# EAGLE design ws2812_Sqaure (EAGLE 8.7.1)
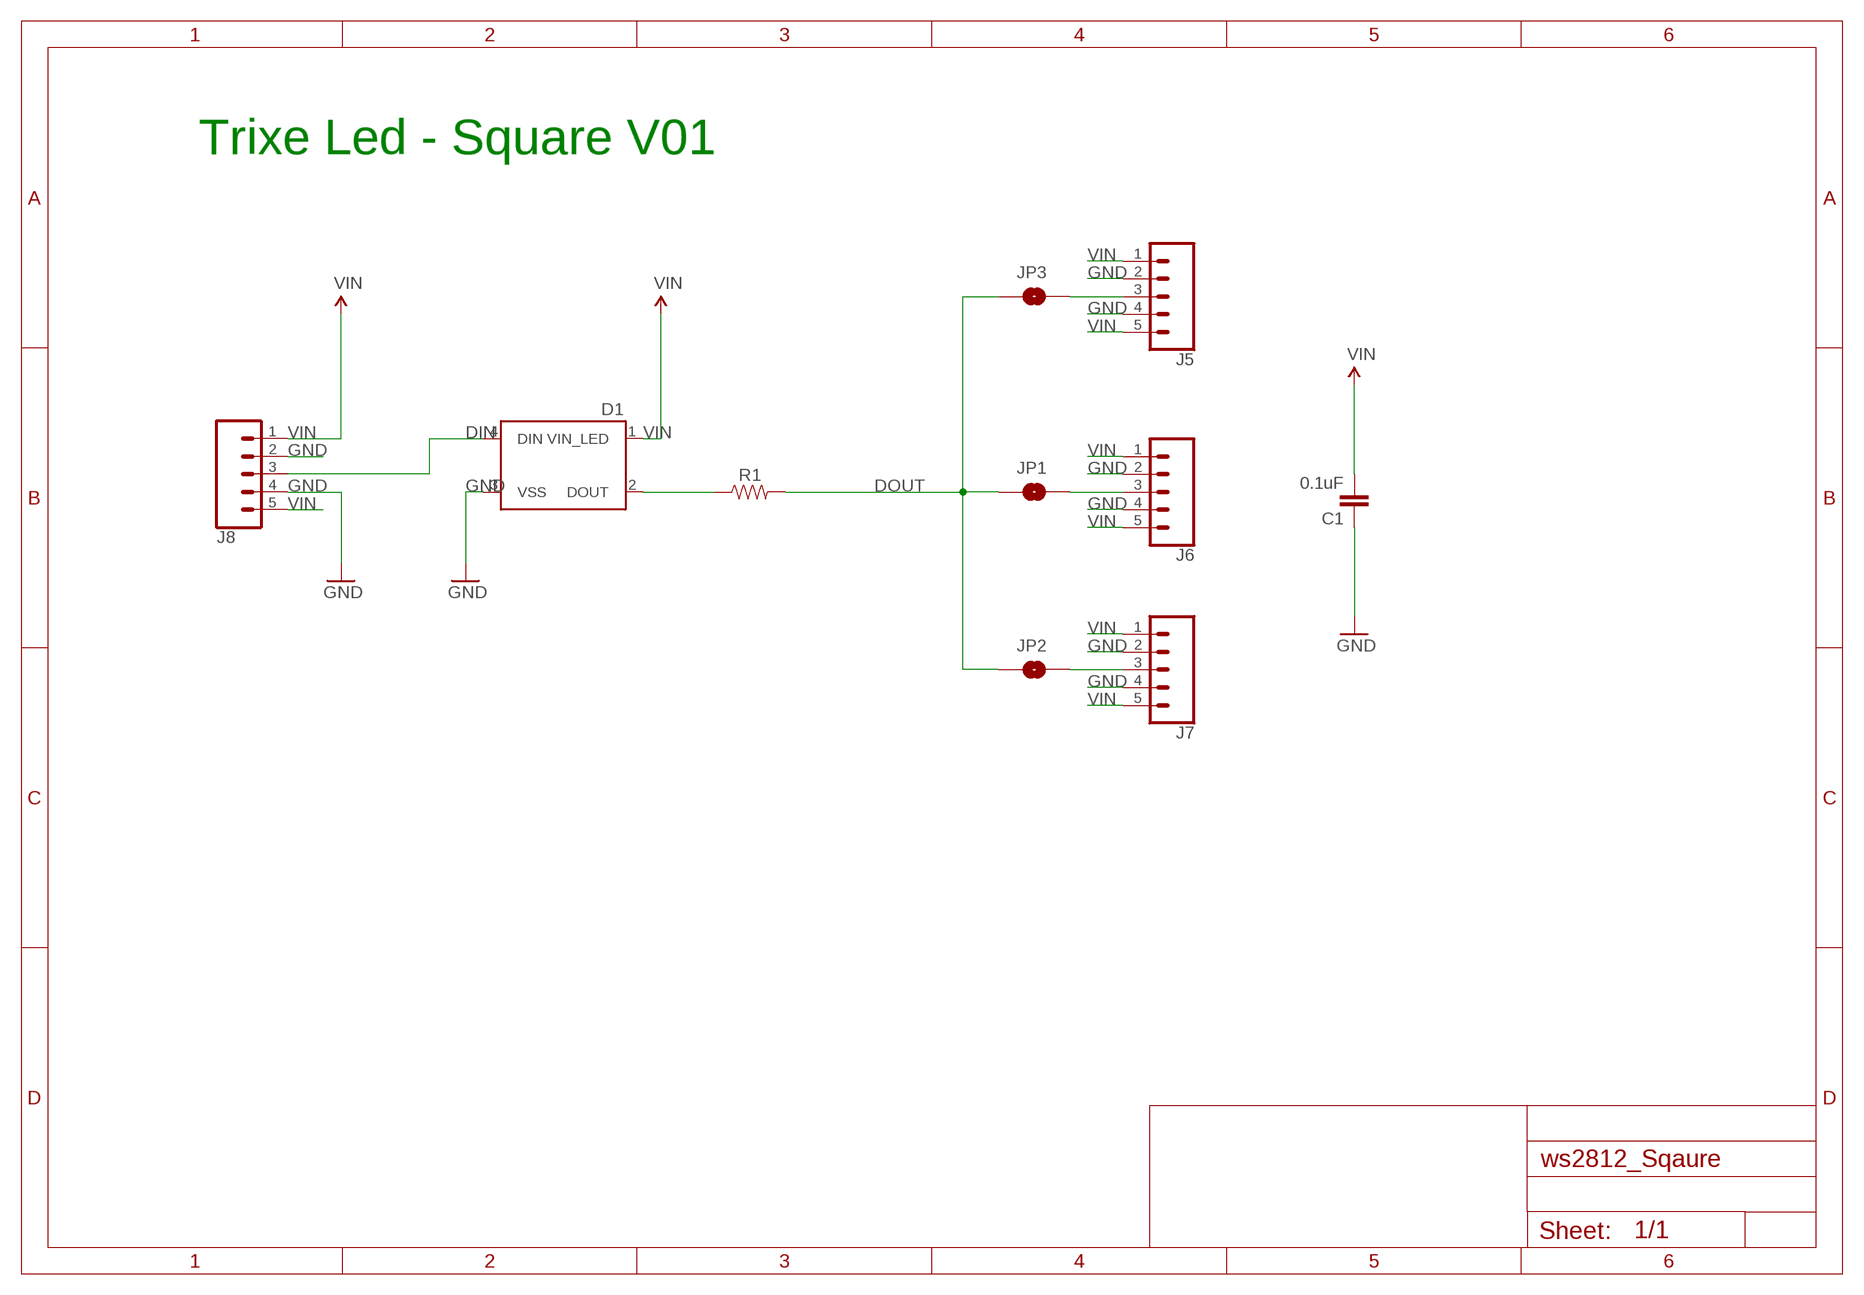
[diagram p0: schematic, sheet 1]

## Parts
C1  0.1uF  CAP0805  [0805]
D1  WS2812B  [WS2812B]
J5  CONN_05PTH_LONGPADS  [1X05_LONGPADS]
J6  CONN_05PTH_LONGPADS  [1X05_LONGPADS]
J7  CONN_05PTH_LONGPADS  [1X05_LONGPADS]
J8  CONN_05PTH_LONGPADS  [1X05_LONGPADS]
JP1  JUMPER-PAD-2-NOYES_SILK  [PAD-JUMPER-2-NO_YES_SILK]
JP2  JUMPER-PAD-2-NOYES_SILK  [PAD-JUMPER-2-NO_YES_SILK]
JP3  JUMPER-PAD-2-NOYES_SILK  [PAD-JUMPER-2-NO_YES_SILK]
R1  RESISTOR0805  [0805]

## Nets
DIN: D1.4(DIN) J8.3
DOUT: JP1.1 JP2.1 JP3.1 R1.2
GND: C1.1 D1.3(VSS) J5.2 J5.4 J6.2 J6.4 J7.2 J7.4 J8.2 J8.4
N$1: J7.3 JP2.2
N$2: J6.3 JP1.2
N$3: J5.3 JP3.2
N$4: D1.2(DOUT) R1.1
VIN: C1.2 D1.1(VIN_LED) J5.1 J5.5 J6.1 J6.5 J7.1 J7.5 J8.1 J8.5

## Notes on the sheet
- Trixe Led - Square V01

## Library data of the parts
C1 = SparkFun-Capacitors:CAP: Capacitor Standard 0603 ceramic capacitor, and 0.1" leaded capacitor.
D1 = SparkFun-LED:WS2812B: WS2812B - Intelligent control LED integrated light source Technical Specifications: Power Supply Voltage (VDD): 3.5 to 5.3 V Input Voltage (VI): -0.5 to VDD+0.5 V Operating Junction Temperature (Topt): -25°C to +80°C Storage Temperature Range (Tstg): -55°C to +150°C; PROD_ID: DIO-12503
J5-J8 = SparkFun-Connectors:CONN_05: Multi connection point. Often used as Generic Header-pin footprint for 0.1 inch spaced/style header connections On any of the 0.1 inch spaced packages, you can populate with these: Break Away Headers - Straight <https://www.sparkfun.com/products/116> (PRT-00116) Break Away Male Headers - Right Angle <https://www.sparkfun.com/products/553> (PRT-00553) Female Headers <https://www.sparkfun.com/products/115> (PRT-00115) Break Away Headers - Machine Pin <https://www.sparkfun.com/products/117> (PRT-00117) Break Away Female Headers - Swiss Machine Pin <https://www.sparkfun.com/products/743> (PRT-00743) For SCREWTERMINALS and SPRING TERMINALS visit here: Screw Terimnals on SparkFun.com <https://www.sparkfun.com/search/results?term=Screw+Terminals> (5mm/3.5mm/2.54mm spacing) This device is also useful as a general connection point to wire up your design to another part of your project. Our various solder wires solder well into these plated through hole pads. Hook-Up Wire - Assortment (Stranded, 22 AWG) <https://www.sparkfun.com/products/11375> (PRT-11375) Hook-Up Wire - Assortment (Solid Core, 22 AWG) <https://www.sparkfun.com/products/11367> (PRT-11367) View the entire wire category on our website here <https://www.sparkfun.com/categories/141> Special notes: Molex polarized connector foot print use with SKU : PRT-08231 with associated crimp pins and housings. 1MM SMD Version SKU: PRT-10208
JP1-JP3 = SparkFun-Passives:JUMPER-PAD-2-NO
R1 = SparkFun-Resistors:RESISTOR: Generic Resistor Package

## Board
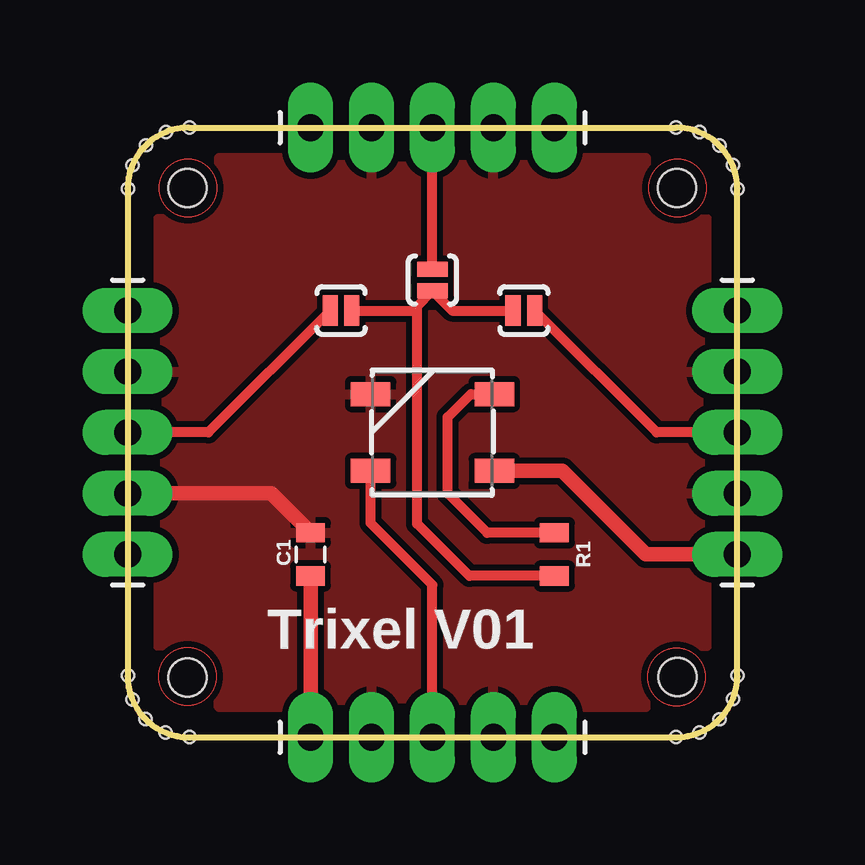
[diagram p1: board, top side]
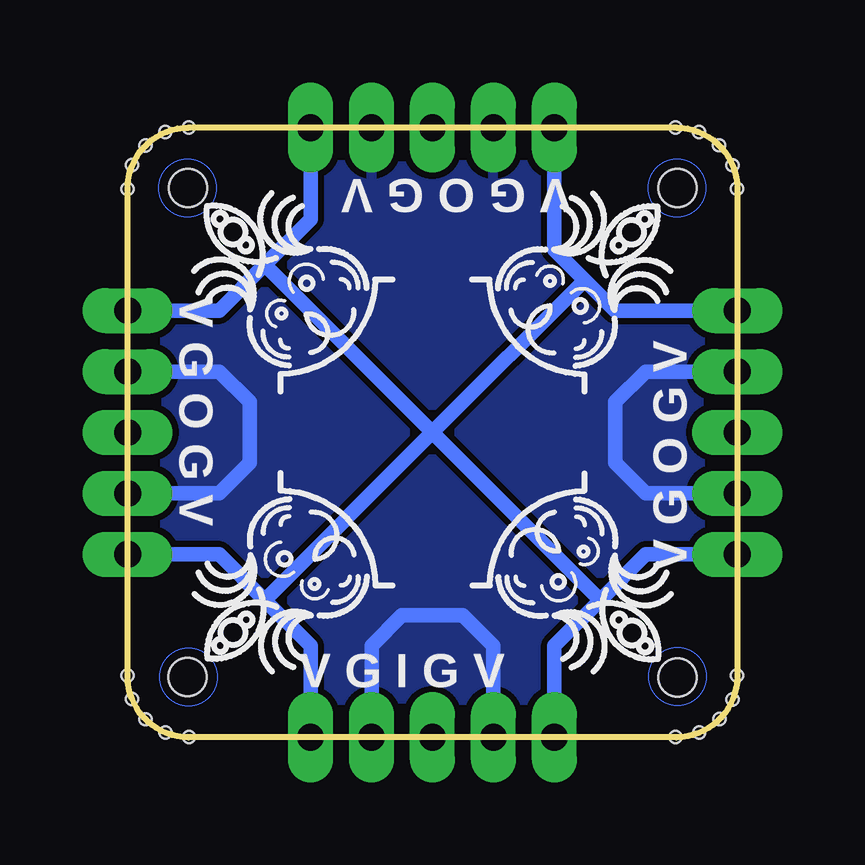
[diagram p2: board, bottom side, seen from below]

Size 25.4 x 25.4 mm. Coordinates in mm from the lower left corner, seen from the top.
Outline: 2.54,0 22.86,0 arc90 25.4,2.54 25.4,22.86 arc90 22.86,25.4 2.54,25.4 arc90 0,22.86 0,2.54 arc90 2.54,0
Copper layers (1*16): Top 0.035mm / dielectric 1.5mm / Bottom 0.035mm
Design rules "SeeedStudio_2layer_DRU_no_angle_20140221 *": minimum track width 6mil, minimum drill 12mil, track to track 6mil, track to pad 6mil, pad to pad 6mil, via to via 6mil, smd to smd 0mil, copper to edge 10mil, drill to drill 10mil, minimum pad ring 10mil, minimum via ring 6mil, stop-mask expansion 2mil, vias tented up to drill 20mil, thermal gap 10mil
Holes 1.6 mm at 2.49,2.49 2.49,22.89 22.91,2.51 22.89,22.89
Holes 0.5 mm at 0.76,24.67 1.59,25.22 2.57,25.41 0.2,23.83 0.01,22.85 22.85,25.41 23.83,25.22 24.66,24.66 25.22,23.84 25.41,22.84 0.01,2.57 0.2,1.58 0.75,0.76 1.58,0.2 2.58,0 22.85,0 23.83,0.2 24.66,0.75 25.22,1.59 25.41,2.57

### Footprints (pad centres in the part's own frame; a part is rotated, then mirrored left to right if it is on the bottom)
0805 = smd 0.8 x 1.2: 1 -0.9,0; 2 0.9,0
WS2812B = smd 1.651 x 1: 1 -2.577,1.6; 2 -2.577,-1.6; 3 2.577,-1.6; 4 2.577,1.6
1X05_LONGPADS = drill 1.118 pad 1.88 long: 1 0,0; 2 2.54,0; 3 5.08,0; 4 7.62,0; 5 10.16,0
PAD-JUMPER-2-NO_YES_SILK = smd 0.635 x 1.27: 1 -0.45,0; 2 0.45,0

### Placement (x,y rotation side)
C1  7.62,7.62 270 top
D1  12.7,12.7 180 top
J5  0,7.62 90 top
J6  25.4,7.62 90 top
J7  7.62,25.4 0 top
J8  7.62,0 0 top
JP1  16.51,17.78 0 top
JP2  12.7,19.05 90 top
JP3  8.89,17.78 180 top
R1  17.78,7.62 270 top

### Tracks (layer width: path | path; a pad name or v marks a point on that pad's centre or on a via)
DIN
  Top 0.406: J8.3 12.7,6.35 10.12,8.93 D1.4
DOUT
  Top 0.406: JP2.1 11.88,17.78 JP3.1 | JP2.1 13.52,17.78 JP1.1 | R1.2 14.23,6.72 12.06,8.89 12.06,17.96 JP2.1
GND
  Top 0.61: C1.1 5.98,10.16 J5.2
  Bottom 0.61: J5.2 3.81,10.16 5.08,11.43 5.08,13.97 3.81,15.24 J5.4 | J6.2 21.59,10.16 20.32,11.43 20.32,13.97 21.59,15.24 J6.4 | J8.4 15.24,3.81 13.97,5.08 11.43,5.08 10.16,3.81 J8.2
  pour Top (isolate 0.254): 3.81,1.27 21.59,1.27 24.13,3.81 24.13,21.59 21.59,24.13 3.81,24.13 1.27,21.59 1.27,3.81
  pour Bottom (isolate 0.254): 1.27,5.08 1.27,3.81 3.81,1.27 21.59,1.27 24.13,3.81 24.13,21.59 21.59,24.13 3.81,24.13 1.27,21.59
N$1
  Top 0.406: JP2.2 J7.3
N$2
  Top 0.406: J6.3 22.04,12.7 JP1.2
N$3
  Top 0.406: JP3.2 3.36,12.7 J5.3
N$4
  Top 0.406: R1.1 14.97,8.52 13.34,10.16 13.34,13.34 14.3,14.3 D1.2
VIN
  Top 0.61: J8.1 C1.2 | D1.1 18.11,11.1 21.59,7.62 J6.1
  Bottom 0.61: J8.1 7.62,3.81 5.71,5.71 | 5.71,5.71 3.81,7.62 J5.1 | J8.5 17.78,3.81 19.68,5.71 | 19.68,5.71 21.59,7.62 J6.1 | J6.5 21.59,17.78 19.68,19.68 | 19.68,19.68 17.78,21.59 J7.5 | J7.1 7.62,20.32 6.35,19.05 | 6.35,19.05 5.08,17.78 J5.5 | 19.68,5.71 12.7,12.7 | 12.7,12.7 6.35,19.05 | 19.68,19.68 12.7,12.7 | 12.7,12.7 5.71,5.71
(copper drawn outside any net)
  shapes: Bottom circle x4, Top circle x4

### Text on the board
tPlace: Trixel V01
bPlace: V G O G V | V G O G V | V G O G V | V G I G V
_tNames: R1 | C1